# Altium schematic sheet PROC_partC_(VDD).SchDoc
size A3
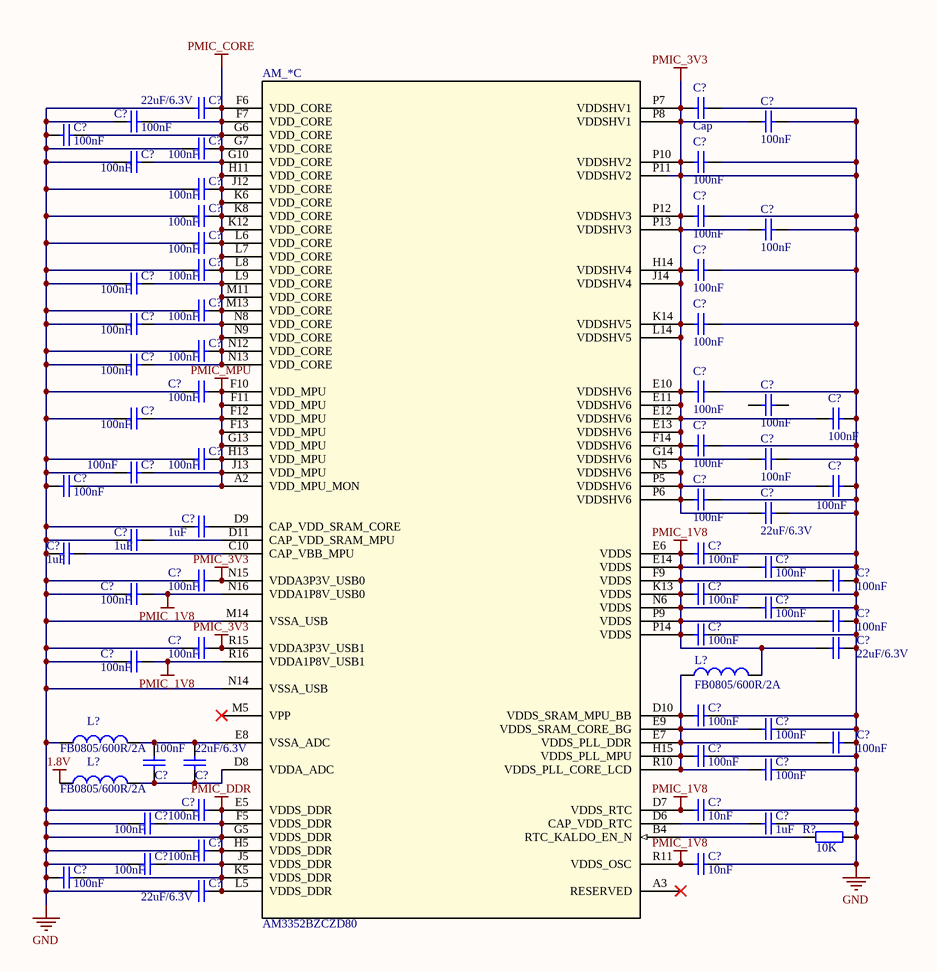
[diagram p0: PROC_partC_(VDD).SchDoc]

## Parts
(Parts that share a designator on the sheet are numbered #1, #2 ... from top to bottom, then left to right.)
AM_*  AM3352BZCZD80  [BGA324C80P18X18_800X1508X1508]  (part C of 4)
C?#1  22uF/6.3V  [0402]
C?#2  Cap  [0402]
C?#3  100nF  [0402]
C?#4  100nF  [0402]
C?#5  100nF  [0402]
C?#6  100nF  [0402]
C?#7  100nF  [0402]
C?#8  100nF  [0402]
C?#9  100nF  [0402]
C?#10  100nF  [0402]
C?#11  100nF  [0402]
C?#12  100nF  [0402]
C?#13  100nF  [0402]
C?#14  100nF  [0402]
C?#15  100nF  [0402]
C?#16  100nF  [0402]
C?#17  100nF  [0402]
C?#18  100nF  [0402]
C?#19  100nF  [0402]
C?#20  100nF  [0402]
C?#21  100nF  [0402]
C?#22  100nF  [0402]
C?#23  100nF  [0402]
C?#24  100nF  [0402]
C?#25  100nF  [0402]
C?#26  100nF  [0402]
C?#27  100nF  [0402]
C?#28  100nF  [0402]
C?#29  100nF  [0402]
C?#30  100nF  [0402]
C?#31  100nF  [0402]
C?#32  100nF  [0402]
C?#33  100nF  [0402]
C?#34  22uF/6.3V  [0402]
C?#35  1uF  [0402]
C?#36  1uF  [0402]
C?#37  1uF  [0402]
C?#38  100nF  [0402]
C?#39  100nF  [0402]
C?#40  100nF  [0402]
C?#41  100nF  [0402]
C?#42  100nF  [0402]
C?#43  100nF  [0402]
C?#44  100nF  [0402]
C?#45  100nF  [0402]
C?#46  100nF  [0402]
C?#47  100nF  [0402]
C?#48  22uF/6.3V  [0402]
C?#49  100nF  [0402]
C?#50  100nF  [0402]
C?#51  100nF  [0402]
C?#52  100nF  [0402]
C?#53  100nF  [0402]
C?#54  22uF/6.3V  [0402]
C?#55  100nF  [0402]
C?#56  100nF  [0402]
C?#57  100nF  [0402]
C?#58  10nF  [0402]
C?#59  100nF  [0402]
C?#60  1uF  [0402]
C?#61  100nF  [0402]
C?#62  100nF  [0402]
C?#63  10nF  [0402]
C?#64  100nF  [0402]
C?#65  22uF/6.3V  [0402]
L?#1  FB0805/600R/2A  [6-0805_M]
L?#2  FB0805/600R/2A  [6-0805_M]
L?#3  FB0805/600R/2A  [6-0805_M]
R?  10K  [AXIAL-0.4]

## Nets
1.8V: L?#3.1
GND: AM_*.E5(VDDS_DDR) AM_*.E10(VDDSHV6) AM_*.E11(VDDSHV6) AM_*.E12(VDDSHV6) AM_*.E13(VDDSHV6) AM_*.F5(VDDS_DDR) AM_*.F14(VDDSHV6) AM_*.G5(VDDS_DDR) AM_*.G14(VDDSHV6) AM_*.H5(VDDS_DDR) AM_*.H14(VDDSHV4) AM_*.J5(VDDS_DDR) AM_*.J14(VDDSHV4) AM_*.K5(VDDS_DDR) AM_*.K14(VDDSHV5) AM_*.L5(VDDS_DDR) AM_*.L14(VDDSHV5) AM_*.M14(VSSA_USB) AM_*.N5(VDDSHV6) AM_*.N14(VSSA_USB) AM_*.N15(VDDA3P3V_USB0) AM_*.P5(VDDSHV6) AM_*.P6(VDDSHV6) AM_*.P7(VDDSHV1) AM_*.P8(VDDSHV1) AM_*.P10(VDDSHV2) AM_*.P11(VDDSHV2) AM_*.P12(VDDSHV3) AM_*.P13(VDDSHV3) AM_*.R15(VDDA3P3V_USB1) C?#1.2 C?#2.1 C?#2.2 C?#3.2 C?#4.1 C?#4.2 C?#5.2 C?#6.2 C?#7.2 C?#8.1 C?#8.2 C?#9.2 C?#10.2 C?#11.1 C?#11.2 C?#12.1 C?#12.2 C?#13.2 C?#14.2 C?#15.1 C?#15.2 C?#16.2 C?#17.2 C?#18.2 C?#19.1 C?#19.2 C?#20.2 C?#21.2 C?#22.2 C?#23.1 C?#23.2 C?#25.2 C?#26.1 C?#26.2 C?#27.1 C?#27.2 C?#28.2 C?#29.1 C?#29.2 C?#30.2 C?#31.2 C?#32.1 C?#32.2 C?#33.1 C?#33.2 C?#34.1 C?#34.2 C?#35.2 C?#36.2 C?#37.2 C?#38.1 C?#39.1 C?#40.1 C?#40.2 C?#41.1 C?#42.2 C?#43.1 C?#44.1 C?#45.1 C?#46.1 C?#47.1 C?#47.2 C?#48.1 C?#49.2 C?#50.1 C?#51.1 C?#53.1 C?#55.1 C?#56.1 C?#57.1 C?#57.2 C?#58.1 C?#59.1 C?#59.2 C?#60.1 C?#61.1 C?#61.2 C?#62.1 C?#62.2 C?#63.1 C?#64.1 C?#64.2 C?#65.1 C?#65.2 L?#2.1 R?.1  [also labelled PMIC_3V3, PMIC_DDR]
PMIC_1V8: AM_*.D7(VDDS_RTC) AM_*.E6(VDDS) AM_*.E14(VDDS) AM_*.F9(VDDS) AM_*.K13(VDDS) AM_*.N6(VDDS) AM_*.N16(VDDA1P8V_USB0) AM_*.P9(VDDS) AM_*.P14(VDDS) AM_*.R11(VDDS_OSC) AM_*.R16(VDDA1P8V_USB1) C?#38.2 C?#39.2 C?#41.2 C?#42.1 C?#43.2 C?#44.2 C?#45.2 C?#46.2 C?#48.2 C?#49.1 C?#58.2 C?#63.2 L?#1.2
PMIC_CORE: AM_*.F6(VDD_CORE) AM_*.F7(VDD_CORE) AM_*.G6(VDD_CORE) AM_*.G7(VDD_CORE) AM_*.G10(VDD_CORE) AM_*.H11(VDD_CORE) AM_*.J12(VDD_CORE) AM_*.K6(VDD_CORE) AM_*.K8(VDD_CORE) AM_*.K12(VDD_CORE) AM_*.L6(VDD_CORE) AM_*.L7(VDD_CORE) AM_*.L8(VDD_CORE) AM_*.L9(VDD_CORE) AM_*.M11(VDD_CORE) AM_*.M13(VDD_CORE) AM_*.N8(VDD_CORE) AM_*.N9(VDD_CORE) AM_*.N12(VDD_CORE) AM_*.N13(VDD_CORE) C?#1.1 C?#3.1 C?#5.1 C?#6.1 C?#7.1 C?#9.1 C?#10.1 C?#13.1 C?#14.1 C?#16.1 C?#17.1 C?#18.1 C?#20.1 C?#21.1
PMIC_MPU: AM_*.A2(VDD_MPU_MON) AM_*.F10(VDD_MPU) AM_*.F11(VDD_MPU) AM_*.F12(VDD_MPU) AM_*.F13(VDD_MPU) AM_*.G13(VDD_MPU) AM_*.H13(VDD_MPU) AM_*.J13(VDD_MPU) C?#22.1 C?#25.1 C?#28.1 C?#30.1 C?#31.1
NetAM_*_B4: AM_*.B4(RTC_KALDO_EN_N) R?.2
NetAM_*_C10: AM_*.C10(CAP_VBB_MPU) C?#37.1
NetAM_*_D6: AM_*.D6(CAP_VDD_RTC) C?#60.2
NetAM_*_D8: AM_*.D8(VDDA_ADC) C?#52.2 C?#54.1 L?#3.2
NetAM_*_D9: AM_*.D9(CAP_VDD_SRAM_CORE) C?#35.1
NetAM_*_D10: AM_*.D10(VDDS_SRAM_MPU_BB) AM_*.E7(VDDS_PLL_DDR) AM_*.E9(VDDS_SRAM_CORE_BG) AM_*.H15(VDDS_PLL_MPU) AM_*.R10(VDDS_PLL_CORE_LCD) C?#50.2 C?#51.2 C?#53.2 C?#55.2 C?#56.2 L?#1.1
NetAM_*_D11: AM_*.D11(CAP_VDD_SRAM_MPU) C?#36.1
NetAM_*_E8: AM_*.E8(VSSA_ADC) C?#52.1 C?#54.2 L?#2.2

Not connected (* = marked no-connect by the designer): AM_* A3(RESERVED)* M5(VPP)*; C?#24 1 2

## Library data of the parts
AM_* = AM3352BZCZD80: Microprocesseur ARM; Fabricant: Texas Instrument; Fournisseur: Farnell; RefFabricant: AM3352BZCZ100; RefFournisseur: 2494119; Value: Value
C?#1-C?#65 = Cap: Capacitor; Value: 100pF; Published: 8-Jun-2000; LatestRevisionDate: 17-Jul-2002; LatestRevisionNote: Re-released for DXP Platform.; PackageReference: RAD-0.3; Publisher: Altium Limited; PackageDescription: Radial Cap, Thru-Hole; 2 Leads; 0.3 in Pin Spacing
L?#1-L?#3 = Inductor: Code_IEC: 1005; Value: 10mH; Published: 8-Jun-2000; LatestRevisionDate: 29-May-2009; LatestRevisionNote: IPC-7351 Footprint Added.; PackageReference: 0402-A; Publisher: Altium Limited; PackageDescription: Chip Inductor; Code_JEITA: 0402
R? = Res2: Resistor; Value: 1K; Published: 8-Jun-2000; LatestRevisionDate: 17-Jul-2002; LatestRevisionNote: Re-released for DXP Platform.; PackageReference: AXIAL-0.4; Publisher: Altium Limited; PackageDescription: Axial Device, Thru-Hole; 2 Leads; 0.4 in Pin Spacing